# EAGLE schematic Banshee (EAGLE 9.6.2)
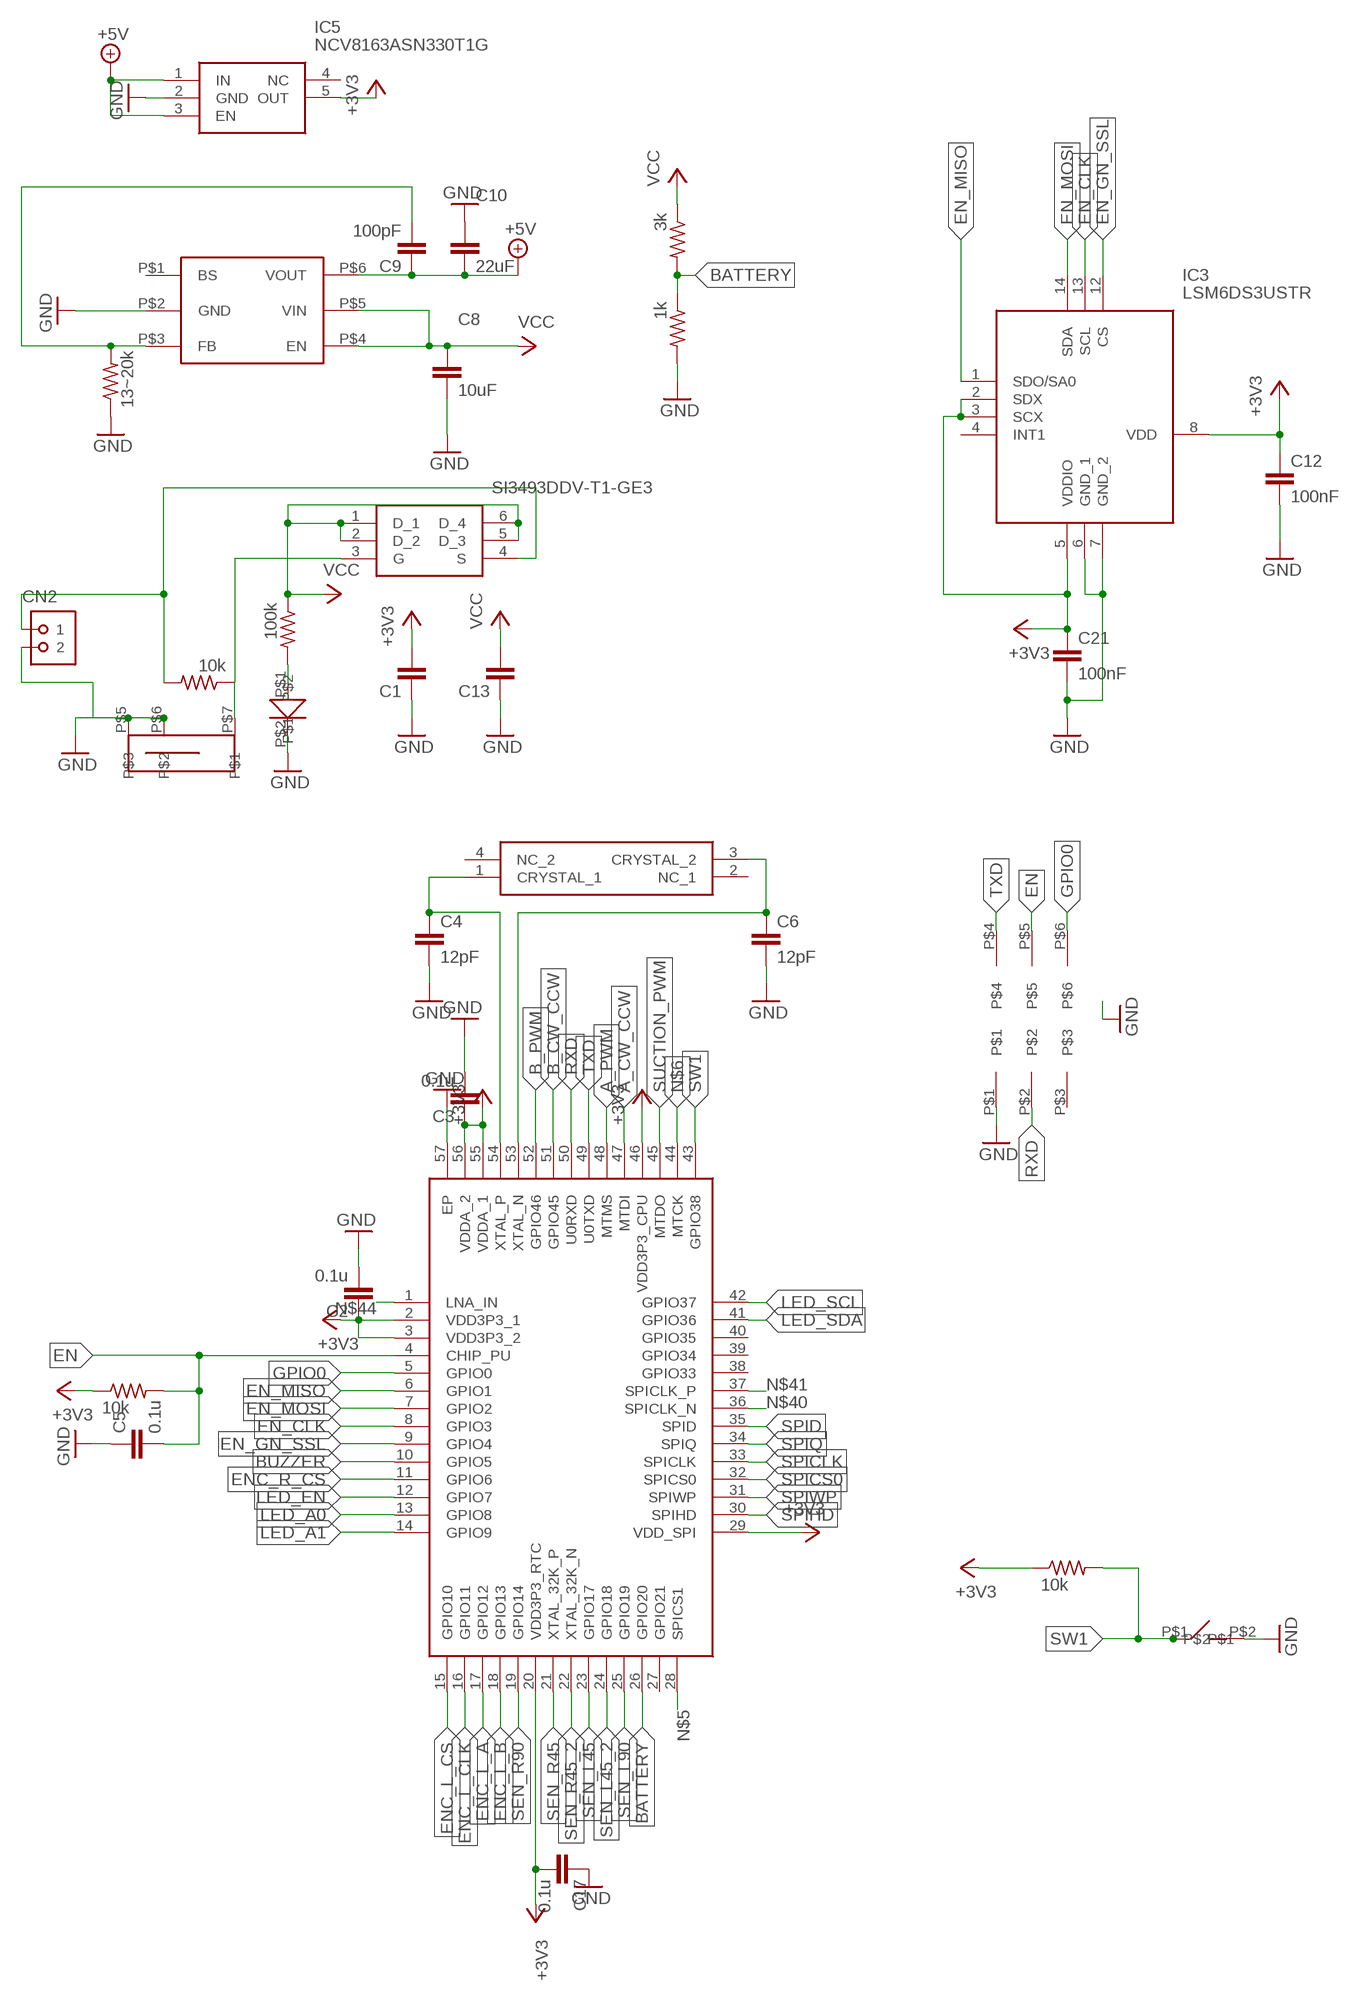
[diagram p0: schematic, sheet 1, part 1 of 2]
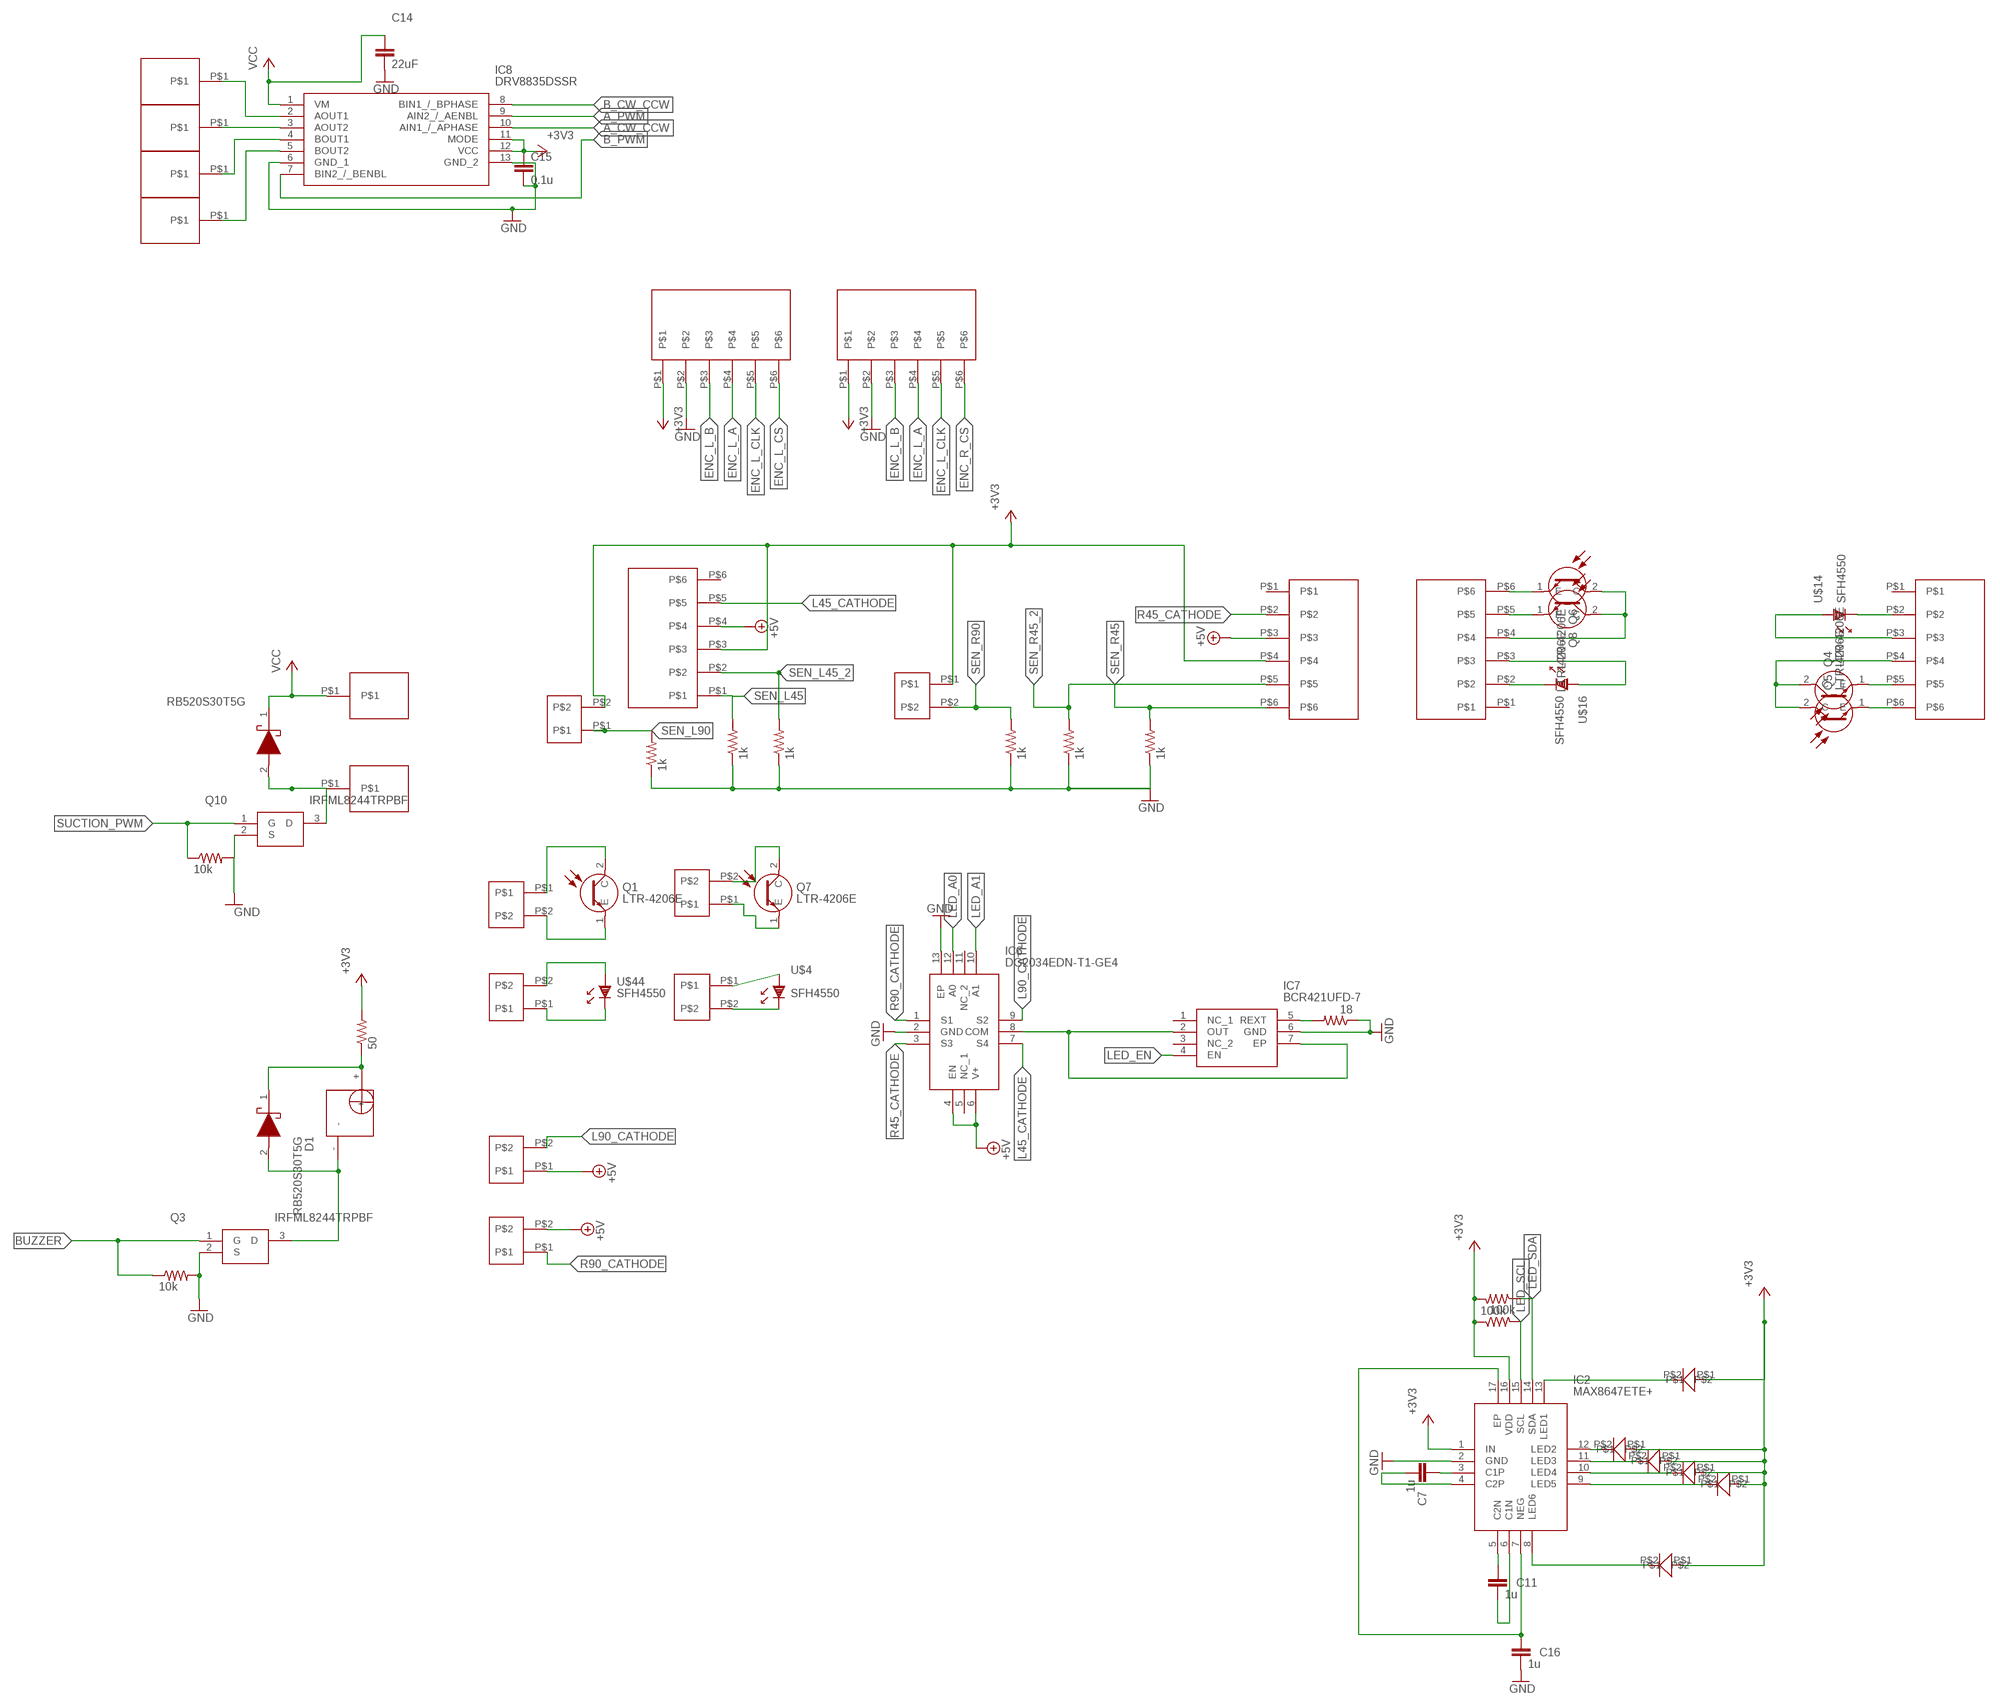
[diagram p1: schematic, sheet 1, part 2 of 2]

## Parts
C1  C3216  [C3216]
C2  0.1u  C1005  [R1005]
C3  0.1u  C1005  [R1005]
C4  12pF  C1005  [R1005]
C5  0.1u  C1005  [R1005]
C6  12pF  C1005  [R1005]
C7  1u  C1005  [R1005]
C8  10uF  C3216  [C3216]
C9  100pF  C1005  [R1005]
C10  22uF  C3216  [C3216]
C11  1u  C1005  [R1005]
C12  100nF  C1005  [R1005]
C13  C3216  [C3216]
C14  22uF  C3216  [C3216]
C15  0.1u  C1005  [R1005]
C16  1u  C1005  [R1005]
C17  0.1u  C1005  [R1005]
C21  100nF  C1005  [R1005]
CN2  HRCON-2  [HRCON-2]
D1  RB520S30T5G  [SODFL1608X70N]
D2  RB520S30T5G  [SODFL1608X70N]
IC1  ESP32-S3-WROOM-1-N8  [QFN40P700X700X90-57N]
IC2  MAX8647ETE+  [QFN50P300X300X80-17N]
IC3  LSM6DS3USTR  [LGA-14(2.5X3X0.86)]
IC5  NCV8163ASN330T1G  [SOT95P275X110-5N]
IC6  DG2034EDN-T1-GE4  [QFN50P300X300X100-13N]
IC7  BCR421UFD-7  [BCR421UFD7]
IC8  DRV8835DSSR  [DRV8835DSSR]
Q1  LTR-4206E  [LTR4206E]
Q2  SI3493DDV-T1-GE3  [SOT95P284X110-6N]
Q3  IRFML8244TRPBF  [SOT95P237X112-3N]
Q4  LTR-4206E  [LTR4206E]
Q5  LTR-4206E  [LTR4206E]
Q6  LTR-4206E  [LTR4206E]
Q7  LTR-4206E  [LTR4206E]
Q8  LTR-4206E  [LTR4206E]
Q10  IRFML8244TRPBF  [SOT95P237X112-3N]
R1  10k  R1005  [R1005]
R2  3k  R1005  [R1005]
R3  1k  R1005  [R1005]
R4  100k  R1005  [R1005]
R5  50  R1005  [R1005]
R7  10k  R1005  [R1005]
R8  10k  R1005  [R1005]
R9  10k  R1005  [R1005]
R10  10k  R1005  [R1005]
R12  100k  R1005  [R1005]
R13  100k  R1005  [R1005]
R15  1k  R1005  [R1005]
R16  1k  R1005  [R1005]
R17  1k  R1005  [R1005]
R18  1k  R1005  [R1005]
R19  18  R1608  [R1608]
R21  1k  R1005  [R1005]
R22  1k  R1005  [R1005]
R25  13~20k  R1005  [R1005]
U$1  SENSOR_FRONT_PAD2  [SENSOR_FRONT_PAD2]
U$2  LED_1005  [LED_1005]
U$3  MUN12AD01-SG  [MUN12AD01-SG]
U$4  SFH4550  [SFH_4550]
U$5  SENSOR_FRONT_PAD2  [SENSOR_FRONT_PAD2]
U$6  PIN2_3  [PIN2_3]
U$7  SENSOR_FRONT_PAD2  [SENSOR_FRONT_PAD2]
U$8  SENSOR_FRONT_PAD2  [SENSOR_FRONT_PAD2]
U$9  SENSOR_FRONT_PAD2  [SENSOR_FRONT_PAD2]
U$10  ENCORDER_1  [ENCORDER_R]
U$11  SENSOR_FRONT_PAD2  [SENSOR_FRONT_PAD2]
U$12  ENCORDER_1  [ENCORDER_R]
U$13  BUZZER_44  [BUZZER]
U$14  SFH4550  [SFH_4550]
U$15  ENCORDER_1  [ENCORDER_R]
U$16  SFH4550  [SFH_4550]
U$17  SENSOR_FRONT_PAD2  [SENSOR_FRONT_PAD2]
U$18  PAD  [PAD]
U$19  LED_1005  [LED_1005]
U$20  SENSOR_FRONT_PAD2  [SENSOR_FRONT_PAD2]
U$21  LED_1005  [LED_1005]
U$22  ENCORDER_1  [ENCORDER_R]
U$23  LED_1005  [LED_1005]
U$24  ENCORDER_1  [ENCORDER_R]
U$25  LED_1005  [LED_1005]
U$26  PAD  [PAD]
U$27  PAD  [PAD]
U$28  ENCORDER_1  [ENCORDER_R]
U$29  PAD  [PAD]
U$30  LED_1005  [LED_1005]
U$31  LED_1005  [LED_1005]
U$43  TVAF06  [TVAF06]
U$44  SFH4550  [SFH_4550]
U$53  SWICH  [SWITCH]
U$57  PAD  [PAD]
U$58  PAD  [PAD]
Y1  XRCGB40M000F5A00R0  [XRCGB32_F]

## Nets
+3V3: C1.2 C2.P$1 C3.P$1 C12.P$1 C15.P$1 C17.P$2 C21.P$1 IC1.2(VDD3P3_1) IC1.3(VDD3P3_2) IC1.20(VDD3P3_RTC) IC1.29(VDD_SPI) IC1.46(VDD3P3_CPU) IC1.55(VDDA_1) IC1.56(VDDA_2) IC2.1(IN) IC2.16(VDD) IC3.2(SDX) IC3.3(SCX) IC3.5(VDDIO) IC3.8(VDD) IC5.5(OUT) IC8.11(MODE) IC8.12(VCC) R1.P$1 R5.P$2 R8.P$1 R12.P$1 R13.P$2 U$5.P$1 U$7.P$2 U$15.P$1 U$19.P$1 U$21.P$1 U$22.P$3 U$23.P$1 U$24.P$4 U$25.P$1 U$28.P$1 U$30.P$1 U$31.P$1
+5V: C9.P$1 C10.2 IC5.1(IN) IC5.3(EN) IC6.4(EN) IC6.6(V+) U$3.P$6(VOUT) U$8.P$1 U$20.P$2 U$22.P$4 U$24.P$3
A_CW_CCW: IC1.47(MTDI) IC8.10(AIN1_/_APHASE)
A_PWM: IC1.48(MTMS) IC8.9(AIN2_/_AENBL)
B_CW_CCW: IC1.51(GPIO45) IC8.8(BIN1_/_BPHASE)
B_PWM: IC1.52(GPIO46) IC8.7(BIN2_/_BENBL)
BATTERY: IC1.26(GPIO20) R2.P$2 R3.P$1
BUZZER: IC1.10(GPIO5) Q3.1(G) R9.P$1
EN: C5.P$2 IC1.4(CHIP_PU) R1.P$2 U$6.P$5
EN_CLK: IC1.8(GPIO3) IC3.13(SCL)
EN_GN_SSL: IC1.9(GPIO4) IC3.12(CS)
EN_MISO: IC1.6(GPIO1) IC3.1(SDO/SA0)
EN_MOSI: IC1.7(GPIO2) IC3.14(SDA)
ENC_L_A: IC1.17(GPIO12) U$15.P$4 U$28.P$4
ENC_L_B: IC1.18(GPIO13) U$15.P$3 U$28.P$3
ENC_L_CLK: IC1.16(GPIO11) U$15.P$5 U$28.P$5
ENC_L_CS: IC1.15(GPIO10) U$15.P$6
ENC_R_CS: IC1.11(GPIO6) U$28.P$6
GND: C1.1 C2.P$2 C3.P$2 C4.P$2 C5.P$1 C6.P$2 C8.2 C10.1 C12.P$2 C13.1 C14.2 C15.P$2 C16.P$2 C17.P$1 C21.P$2 CN2.2 IC1.57(EP) IC2.2(GND) IC3.6(GND_1) IC3.7(GND_2) IC5.2(GND) IC6.2(GND) IC6.13(EP) IC7.6(GND) IC8.6(GND_1) IC8.13(GND_2) Q3.2(S) Q10.2(S) R3.P$2 R9.P$2 R10.P$2 R15.P$1 R16.P$1 R17.P$1 R18.P$1 R19.1 R21.P$1 R22.P$1 R25.P$1 U$2.P$2 U$3.P$2(GND) U$6.P$1 U$15.P$2 U$28.P$2 U$43.P$2 U$53.P$5 U$53.P$6
GPIO0: IC1.5(GPIO0) U$6.P$6
L45_CATHODE: IC6.7(S4) U$22.P$5
L90_CATHODE: IC6.9(S2) U$8.P$2
LED_A0: IC1.13(GPIO8) IC6.12(A0)
LED_A1: IC1.14(GPIO9) IC6.10(A1)
LED_EN: IC1.12(GPIO7) IC7.4(EN)
LED_SCL: IC1.42(GPIO37) IC2.15(SCL) R12.P$2
LED_SDA: IC1.41(GPIO36) IC2.14(SDA) R13.P$1
N$1: D1.1(K) R5.P$1 U$13.+
N$2: IC6.8(COM) IC7.2(OUT) IC7.7(EP)
N$3: D1.2(A) Q3.3(D) U$13.-
N$4: R4.P$2 U$2.P$1
N$5: IC1.28(SPICS1)
N$6: IC1.44(MTCK)
N$7: Q1.2(C) U$1.P$1
N$8: Q1.1(E) U$1.P$2
N$9: U$9.P$2 U$44.ANODE(A)
N$10: U$9.P$1 U$44.CASODE(K)
N$12: IC8.3(AOUT2) U$26.P$1
N$13: IC8.4(BOUT1) U$27.P$1
N$14: Q5.1(E) U$12.P$6
N$15: Q2.3(G) R7.P$1 U$53.P$7
N$16: Q4.1(E) U$12.P$5
N$17: CN2.1 Q2.4(S) R7.P$2
N$18: Q4.2(C) Q5.2(C) U$12.P$4
N$19: D2.2(A) Q10.3(D) U$58.P$1
N$20: U$10.P$2 U$16.CASODE(K)
N$21: U$12.P$3 U$14.ANODE(A)
N$24: Q6.1(E) U$10.P$6
N$25: IC7.5(REXT) R19.2
N$26: U$4.ANODE(A) U$17.P$1
N$27: Q8.1(E) U$10.P$5
N$28: C9.P$2 R25.P$2 U$3.P$3(FB)
N$29: U$4.CASODE(K) U$17.P$2
N$30: IC8.2(AOUT1) U$29.P$1
N$31: Q7.1(E) U$11.P$1
N$32: C4.P$1 IC1.54(XTAL_P) Y1.1(CRYSTAL_1)
N$33: C6.P$1 IC1.53(XTAL_N) Y1.3(CRYSTAL_2)
N$34: Q7.2(C) U$11.P$2
N$36: Q6.2(C) Q8.2(C) U$10.P$4
N$37: U$12.P$2 U$14.CASODE(K)
N$38: U$10.P$3 U$16.ANODE(A)
N$40: IC1.36(SPICLK_N)
N$41: IC1.37(SPICLK_P)
N$44: IC1.1(LNA_IN)
N$45: C7.P$1 IC2.3(C1P)
N$46: C7.P$2 IC2.4(C2P)
N$47: C11.P$1 IC2.5(C2N)
N$48: C11.P$2 IC2.6(C1N)
N$49: C16.P$1 IC2.7(NEG) IC2.17(EP)
N$50: IC2.8(LED6) U$31.P$2
N$51: IC2.13(LED1) U$30.P$2
N$54: IC2.12(LED2) U$23.P$2
N$55: IC2.11(LED3) U$21.P$2
N$56: IC2.10(LED4) U$19.P$2
N$57: IC2.9(LED5) U$25.P$2
N$61: IC8.5(BOUT2) U$57.P$1
R45_CATHODE: IC6.3(S3) U$24.P$2
R90_CATHODE: IC6.1(S1) U$20.P$1
RXD: IC1.50(U0RXD) U$6.P$2
SEN_L45: IC1.23(GPIO17) R17.P$2 U$22.P$1
SEN_L45_2: IC1.24(GPIO18) R21.P$2 U$22.P$2
SEN_L90: IC1.25(GPIO19) R18.P$2 U$7.P$1
SEN_R45: IC1.21(XTAL_32K_P) R16.P$2 U$24.P$6
SEN_R45_2: IC1.22(XTAL_32K_N) R15.P$2 U$24.P$5
SEN_R90: IC1.19(GPIO14) R22.P$2 U$5.P$2
SPICLK: IC1.33(SPICLK)
SPICS0: IC1.32(SPICS0)
SPID: IC1.35(SPID)
SPIHD: IC1.30(SPIHD)
SPIQ: IC1.34(SPIQ)
SPIWP: IC1.31(SPIWP)
SUCTION_PWM: IC1.45(MTDO) Q10.1(G) R10.P$1
SW1: IC1.43(GPIO38) R8.P$2 U$43.P$1
TXD: IC1.49(U0TXD) U$6.P$4
VCC: C8.1 C13.2 C14.1 D2.1(K) IC8.1(VM) Q2.1(D_1) Q2.2(D_2) Q2.5(D_3) Q2.6(D_4) R2.P$1 R4.P$1 U$3.P$4(EN) U$3.P$5(VIN) U$18.P$1
Unconnected: IC1.27(GPIO21) IC1.38(GPIO33) IC1.39(GPIO34) IC1.40(GPIO35) IC3.4(INT1) IC5.4(NC) IC6.5(NC_1) IC6.11(NC_2) IC7.1(NC_1) IC7.3(NC_2) U$3.P$1(BS) U$6.P$3 U$10.P$1 U$12.P$1 U$22.P$6 U$24.P$1 Y1.2(NC_1) Y1.4(NC_2)

## Library data of the parts
C1 C8 C10 C13 C14 = Capacitor:C3216
C2-C7 C9 C11 C12 C15-C17 C21 = Capacitor:C1005
CN2 = Conecter:HRCON-2
D1 D2 = RB520S30T5G:RB520S30T5G: Diode Schottky 30V 0.2A Automotive 2-Pin SOD-523 T/R Source: Datasheet <https://www.onsemi.com/pub/Collateral/RB520S30T1-D.PDF>; DESCRIPTION: Diode Schottky 30V 0.2A Automotive 2-Pin SOD-523 T/R; HEIGHT: 0.7mm; MANUFACTURER_NAME: ON Semiconductor; MANUFACTURER_PART_NUMBER: RB520S30T5G
IC1 = ESP32-S3-WROOM-1-N8:ESP32-S3-WROOM-1-N8: SMD MODULE, ESP32-S3, 8 MB SPI F Source: Datasheet <https://www.espressif.com/sites/default/files/documentation/esp32-s3_datasheet_en.pdf>; DESCRIPTION: SMD MODULE, ESP32-S3, 8 MB SPI F; HEIGHT: 0.9mm; MANUFACTURER_NAME: Espressif Systems; MANUFACTURER_PART_NUMBER: ESP32-S3-WROOM-1-N8
IC2 = MAX8647ETE+:MAX8647ETE+: MAXIM INTEGRATED PRODUCTS - MAX8647ETE+ - LED Driver, Charge Pump, 2.7V to 5.5V in, 6 Outputs, 1 MHz Switch. Frequency, 5V/24 mA out, TQFN-16 Source: Datasheet <https://pdfserv.maximintegrated.com/en/ds/MAX8647-MAX8648.pdf>; DESCRIPTION: MAXIM INTEGRATED PRODUCTS - MAX8647ETE+ - LED Driver, Charge Pump, 2.7V to 5.5V in, 6 Outputs, 1 MHz Switch. Frequency, 5V/24 mA out, TQFN-16; HEIGHT: 0.8mm; MANUFACTURER_NAME: Analog Devices; MANUFACTURER_PART_NUMBER: MAX8647ETE+
IC3 = LSM6DS3USTR:LSM6DS3USTR: IMUs - Inertial Measurement Units CONSUMER MEMS Source: Datasheet <https://datasheet.datasheetarchive.com/originals/distributors/DKDS-20/385281.pdf>; DESCRIPTION: IMUs - Inertial Measurement Units CONSUMER MEMS; HEIGHT: mm; MANUFACTURER_NAME: STMicroelectronics; MANUFACTURER_PART_NUMBER: LSM6DS3USTR
IC5 = NCV8163ASN330T1G:NCV8163ASN330T1G: LDO 250 MA AD 3.3V, ULTRA Source: Datasheet <http://uk.rs-online.com/web/p/products/1858885P>; DESCRIPTION: LDO 250 MA AD 3.3V, ULTRA; HEIGHT: 1.1mm; MANUFACTURER_NAME: onsemi; MANUFACTURER_PART_NUMBER: NCV8163ASN330T1G; RS_PART_NUMBER: 1858885P; RS_PRICE-STOCK: http://uk.rs-online.com/web/p/products/1858885P
IC6 = DG2034EDN-T1-GE4:DG2034EDN-T1-GE4: Gate Drivers 2.5ohm 1.8-5.5V 4:1 Multiplexer Source: Datasheet <http://uk.rs-online.com/web/p/products/1648043P>; DESCRIPTION: Gate Drivers 2.5ohm 1.8-5.5V 4:1 Multiplexer; HEIGHT: 1mm; MANUFACTURER_NAME: Vishay; MANUFACTURER_PART_NUMBER: DG2034EDN-T1-GE4; RS_PART_NUMBER: 1648043P; RS_PRICE-STOCK: http://uk.rs-online.com/web/p/products/1648043P
IC7 = BCR421UFD-7:BCR421UFD-7: LED Lighting Drivers Source: Datasheet <https://componentsearchengine.com/Datasheets/1/BCR421UFD-7.pdf>; DESCRIPTION: LED Lighting Drivers; HEIGHT: 0.63mm; MANUFACTURER_NAME: Diodes Inc.; MANUFACTURER_PART_NUMBER: BCR421UFD-7
IC8 = DRV8835DSSR:DRV8835DSSR: Motor / Motion / Ignition Controllers & Drivers 1.5A Low Vlt Stepper Motor Source: Datasheet <http://uk.rs-online.com/web/p/products/8136485>; DESCRIPTION: Motor / Motion / Ignition Controllers & Drivers 1.5A Low Vlt Stepper Motor; HEIGHT: 0.8mm; MANUFACTURER_NAME: Texas Instruments; MANUFACTURER_PART_NUMBER: DRV8835DSSR; RS_PART_NUMBER: 8136485; RS_PRICE-STOCK: http://uk.rs-online.com/web/p/products/8136485
Q1 Q4-Q8 = LTR-4206E:LTR-4206E: Phototransistors Phototrans Filtered Source: Datasheet <http://optoelectronics.liteon.com/upload/download/DS-50-92-0073/R4206E.pdf>; DESCRIPTION: Phototransistors Phototrans Filtered; HEIGHT: 6.65mm; MANUFACTURER_NAME: Lite-On; MANUFACTURER_PART_NUMBER: LTR-4206E; MOUSER_PART_NUMBER: 859-LTR-4206E; MOUSER_PRICE-STOCK: https://www.mouser.com/Search/Refine.aspx?Keyword=859-LTR-4206E
Q2 = SI3493DDV-T1-GE3:SI3493DDV-T1-GE3: MOSFET -20V Vds 8V Vgs TSOP-6 Source: Datasheet <http://uk.rs-online.com/web/p/products/1349713P>; DESCRIPTION: MOSFET -20V Vds 8V Vgs TSOP-6; HEIGHT: 1.1mm; MANUFACTURER_NAME: Vishay; MANUFACTURER_PART_NUMBER: SI3493DDV-T1-GE3; RS_PART_NUMBER: 1349713P; RS_PRICE-STOCK: http://uk.rs-online.com/web/p/products/1349713P
Q3 Q10 = IRFML8244TRPBF:IRFML8244TRPBF: MOSFET MOSFT 25V 5.8A 24mOhm 5.4 Qg Source: Datasheet <http://uk.rs-online.com/web/p/products/7377219P>; ALLIED_NUMBER: 70411466; DESCRIPTION: MOSFET MOSFT 25V 5.8A 24mOhm 5.4 Qg; HEIGHT: 1.12mm; MANUFACTURER_NAME: Infineon; MANUFACTURER_PART_NUMBER: IRFML8244TRPBF; RS_PART_NUMBER: 7377219P; RS_PRICE-STOCK: http://uk.rs-online.com/web/p/products/7377219P
R1-R5 R7-R10 R12 R13 R15-R18 R21 R22 R25 = Resistor:R1005
R19 = Resistor:R1608
U$1 U$5 U$7-U$9 U$11 U$17 U$20 = sensor_front_pad2:SENSOR_FRONT_PAD2
U$2 U$19 U$21 U$23 U$25 U$30 U$31 = led_1005:LED_1005
U$3 = MUN12AD01-SG:MUN12AD01-SG
U$4 U$14 U$16 U$44 = LED:SFH4550
U$6 = pin2_3:PIN2_3
U$10 U$12 U$15 U$22 U$24 U$28 = endorder_R:ENCORDER_1
U$13 = buzzer_4_4:BUZZER_4*4
U$18 U$26 U$27 U$29 U$57 U$58 = pad:PAD
U$43 = tvaf06_tack_switch:TVAF06
U$53 = switch:SWICH
Y1 = XRCGB40M000F5A00R0:XRCGB40M000F5A00R0: Crystals 2.0x1.6x0.65mm 40MHz Crystal +/-50ppm Initial tolerance Source: Datasheet <https://www.murata.com/en-sg/api/pdfdownloadapi?cate=&partno=XRCGB40M000F5A00R0>; DESCRIPTION: Crystals 2.0x1.6x0.65mm 40MHz Crystal +/-50ppm Initial tolerance; HEIGHT: mm; MANUFACTURER_NAME: Murata Electronics; MANUFACTURER_PART_NUMBER: XRCGB40M000F5A00R0

## Module DD
Ports: 

### Library data of the parts